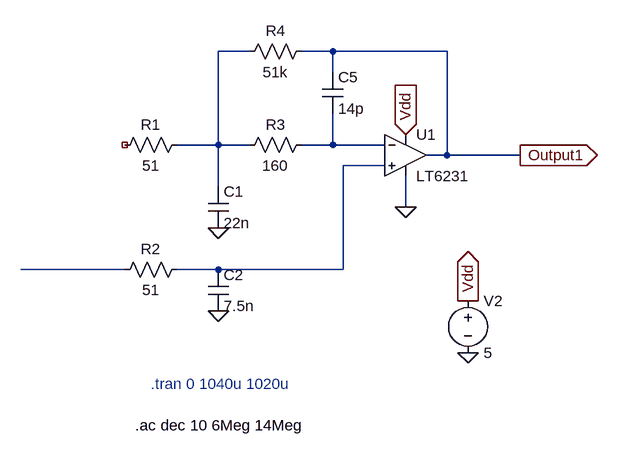
[diagram p0: schematic Multiple feedback low pass amplifier.asc]
Multiple feedback low pass amplifier.asc, the LTspice schematic file:
Version 4
SHEET 1 880 704
WIRE 272 80 224 80
WIRE 400 80 352 80
WIRE 576 80 400 80
WIRE 400 112 400 80
WIRE 224 224 224 80
WIRE 224 224 160 224
WIRE 272 224 224 224
WIRE 400 224 400 176
WIRE 400 224 352 224
WIRE 480 224 400 224
WIRE 576 240 576 80
WIRE 576 240 544 240
WIRE 688 240 576 240
WIRE 480 256 416 256
WIRE 224 288 224 224
WIRE 512 320 512 272
WIRE 80 416 -80 416
WIRE 224 416 160 416
WIRE 416 416 416 256
WIRE 416 416 224 416
FLAG 688 240 Output1
IOPIN 688 240 Out
FLAG 512 208 Vdd
IOPIN 512 208 In
FLAG 512 320 0
FLAG 224 352 0
FLAG 608 544 0
FLAG 608 464 Vdd
IOPIN 608 464 Out
FLAG 224 480 0
SYMBOL res 176 208 R90
WINDOW 0 0 56 VBottom 2
WINDOW 3 32 56 VTop 2
SYMATTR InstName R1
SYMATTR Value 51
SYMBOL cap 208 288 R0
SYMATTR InstName C1
SYMATTR Value 22n
SYMBOL LT6231 512 240 R0
SYMATTR InstName U1
SYMBOL cap 384 112 R0
SYMATTR InstName C5
SYMATTR Value 14p
SYMBOL res 368 208 R90
WINDOW 0 0 56 VBottom 2
WINDOW 3 32 56 VTop 2
SYMATTR InstName R3
SYMATTR Value 160
SYMBOL res 368 64 R90
WINDOW 0 0 56 VBottom 2
WINDOW 3 32 56 VTop 2
SYMATTR InstName R4
SYMATTR Value 51k
SYMBOL voltage 608 448 R0
WINDOW 123 0 0 Left 0
WINDOW 39 0 0 Left 0
SYMATTR InstName V2
SYMATTR Value 5
SYMBOL res 176 400 R90
WINDOW 0 0 56 VBottom 2
WINDOW 3 32 56 VTop 2
SYMATTR InstName R2
SYMATTR Value 51
SYMBOL cap 208 416 R0
SYMATTR InstName C2
SYMATTR Value 7.5n
TEXT 120 592 Left 2 ;.tran 0 1040u 1020u
TEXT 96 656 Left 2 !.ac dec 10 6Meg 14Meg

The netlist it stands for:
* Multiple feedback low pass amplifier.asc
R1 N001 NC_01 51
C1 N001 0 22n
XU1 N003 N002 Output1 Vdd 0 LT6231  ; pins In+ In- OUT V+ V-
C5 Output1 N002 14p
R3 N002 N001 160
R4 Output1 N001 51k
V2 Vdd 0 5
R2 N003 N004 51
C2 N003 0 7.5n
* .tran 0 1040u 1020u
.ac dec 10 6Meg 14Meg
.lib LTC2.lib
.backanno
.end